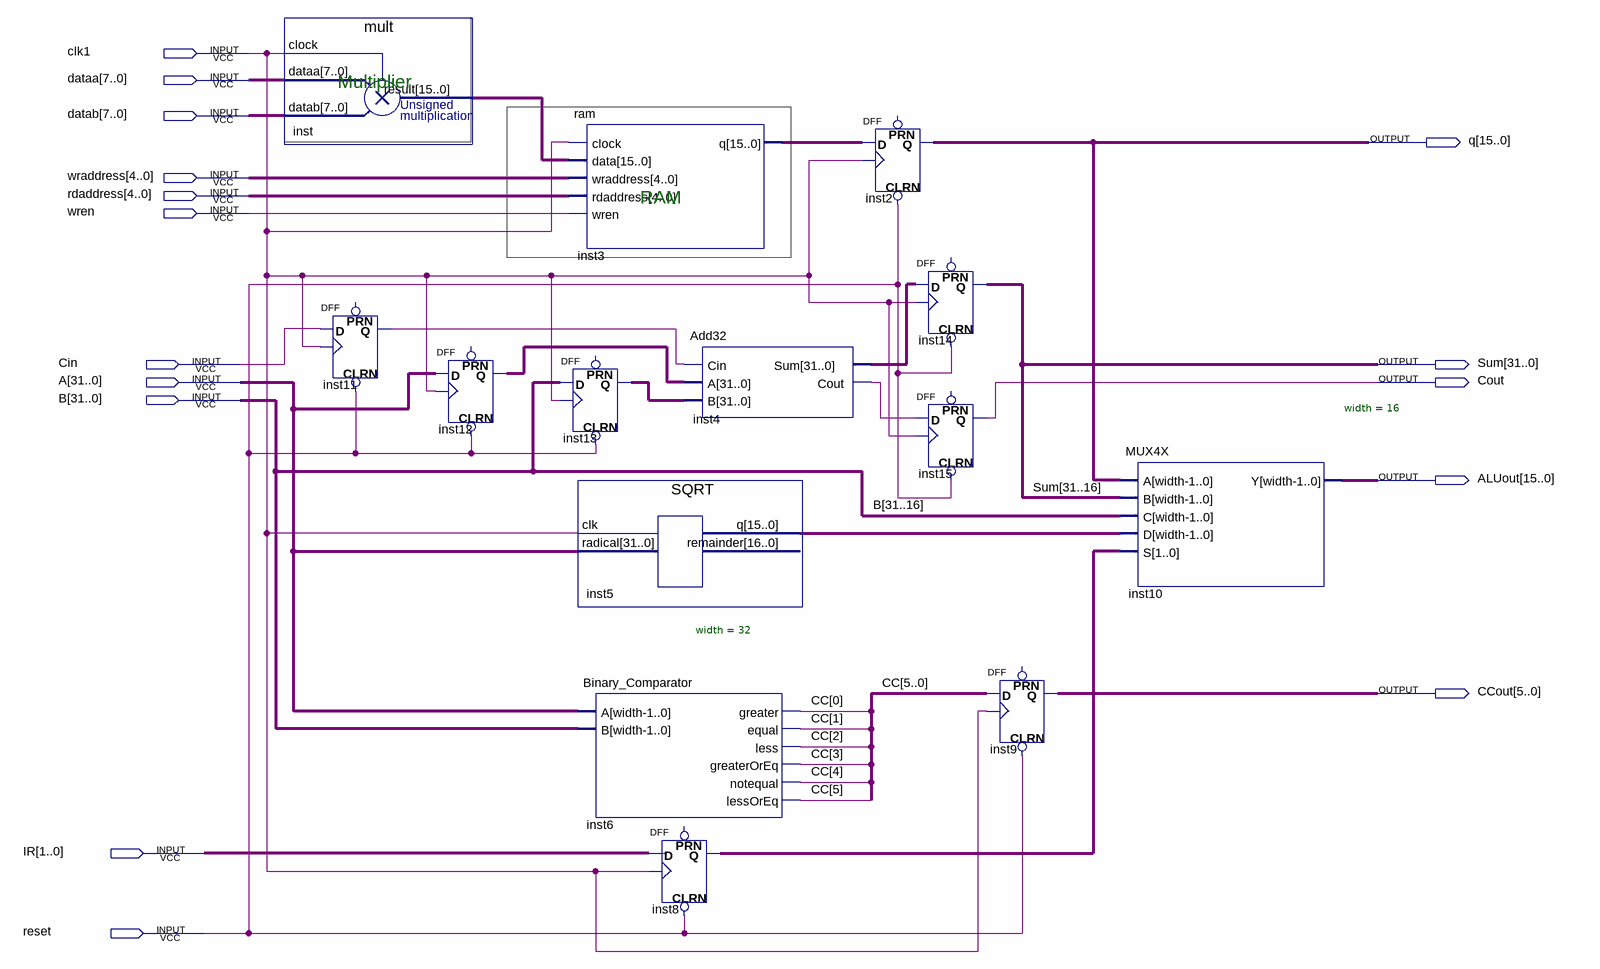
[diagram p0: schematic sheet]
// Quartus schematic pipemult.bdf as structural Verilog: 14 symbols, 16 pins
module pipemult (
  input  clk1,
  input  [7:0] dataa,
  input  [7:0] datab,
  input  [4:0] wraddress,
  input  [4:0] rdaddress,
  input  wren,
  input  Cin,
  input  [31:0] A,
  input  [31:0] B,
  input  [1:0] IR,
  input  reset,
  output [15:0] q,
  output [31:0] Sum,
  output Cout,
  output [15:0] ALUout,
  output [5:0] CCout
);

  wire inst4_cout, inst11_q;
  wire [1:0] inst8_q;
  wire [5:0] CC;
  wire [15:0] inst3_q, inst5_q, inst_result;
  wire [31:0] inst4_sum, inst12_q, inst13_q;

  mult inst (.clock(clk1), .dataa(dataa), .datab(datab), .result(inst_result));
  DFF inst11 (.CLRN(reset), .CLK(clk1), .D(Cin), .Q(inst11_q));  // open: PRN
  DFF inst12[31:0] (.CLRN(reset), .CLK(clk1), .D(A), .Q(inst12_q));  // open: PRN
  ram inst3 (.clock(clk1), .data(inst_result), .wraddress(wraddress), .rdaddress(rdaddress), .wren(wren), .q(inst3_q));
  DFF inst13[31:0] (.CLRN(reset), .CLK(clk1), .D(B), .Q(inst13_q));  // open: PRN
  SQRT inst5 (.clk(clk1), .radical(A), .q(inst5_q));  // open: remainder
  Binary_Comparator #(.width(32)) inst6 (
    .A(A), .B(B), .greater(CC[0]), .equal(CC[1]), .less(CC[2]), .greaterOrEq(CC[3]), .notequal(CC[4]),
    .lessOrEq(CC[5]));
  Add32 inst4 (.Cin(inst11_q), .A(inst12_q), .B(inst13_q), .Sum(inst4_sum), .Cout(inst4_cout));
  DFF inst8[1:0] (.CLRN(reset), .CLK(clk1), .D(IR), .Q(inst8_q));  // open: PRN
  DFF inst2[15:0] (.CLRN(reset), .CLK(clk1), .D(inst3_q), .Q(q));  // open: PRN
  DFF inst14[31:0] (.CLRN(reset), .CLK(clk1), .D(inst4_sum), .Q(Sum));  // open: PRN
  DFF inst15 (.CLRN(reset), .CLK(clk1), .D(inst4_cout), .Q(Cout));  // open: PRN
  DFF inst9[5:0] (.CLRN(reset), .CLK(clk1), .D(CC), .Q(CCout));  // open: PRN
  MUX4X #(.width(16)) inst10 (.A(q), .B(Sum[31:16]), .C(B[31:16]), .D(inst5_q), .S(inst8_q), .Y(ALUout));

  // Notes on the sheet:
  //   Multiplier
  //   RAM
endmodule
